# EAGLE schematic ir_receiver (EAGLE 9.6.2)
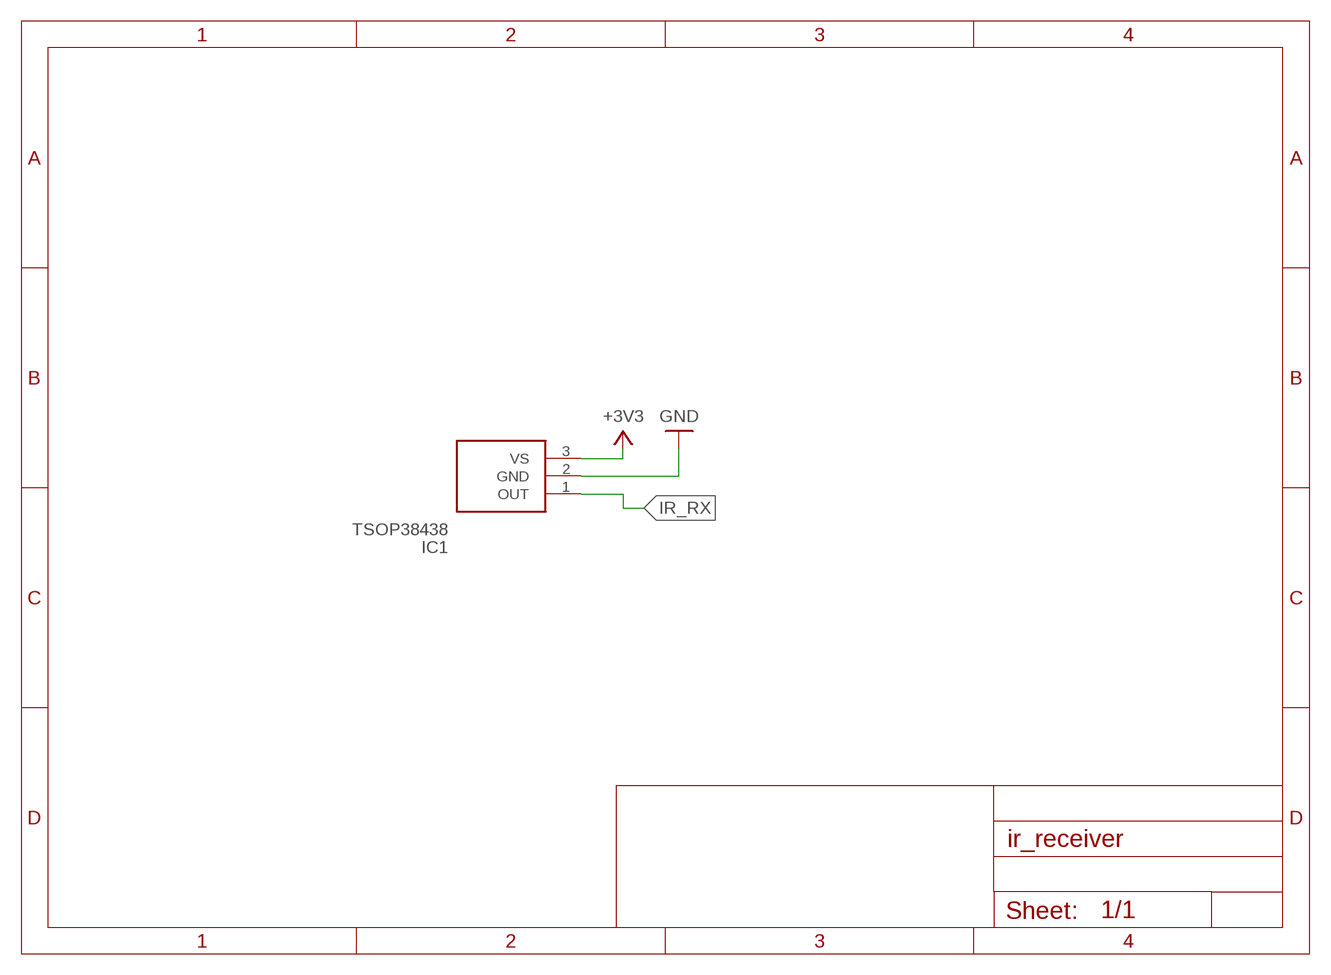
[diagram p0: schematic, sheet 1]

## Parts
IC1  TSOP38438  [TSOP38238]

## Nets
+3V3: IC1.3(VS)
GND: IC1.2(GND)
IR_RX: IC1.1(OUT)

## Library data of the parts
IC1 = TSOP38438:TSOP38438: IR Remote Receiver 38KHz 45m Source: Datasheet <http://www.vishay.com/docs/82491/tsop382.pdf>; DESCRIPTION: IR Remote Receiver 38KHz 45m; HEIGHT: mm; MANUFACTURER_NAME: Vishay; MANUFACTURER_PART_NUMBER: TSOP38438; MOUSER_PART_NUMBER: 78-TSOP38438; MOUSER_PRICE-STOCK: https://www.mouser.co.uk/ProductDetail/Vishay-Semiconductors/TSOP38438?qs=fbkhFuCHoTaKUNuf%2Fea2zA%3D%3D